# Altium project ServoControl.PrjPcb
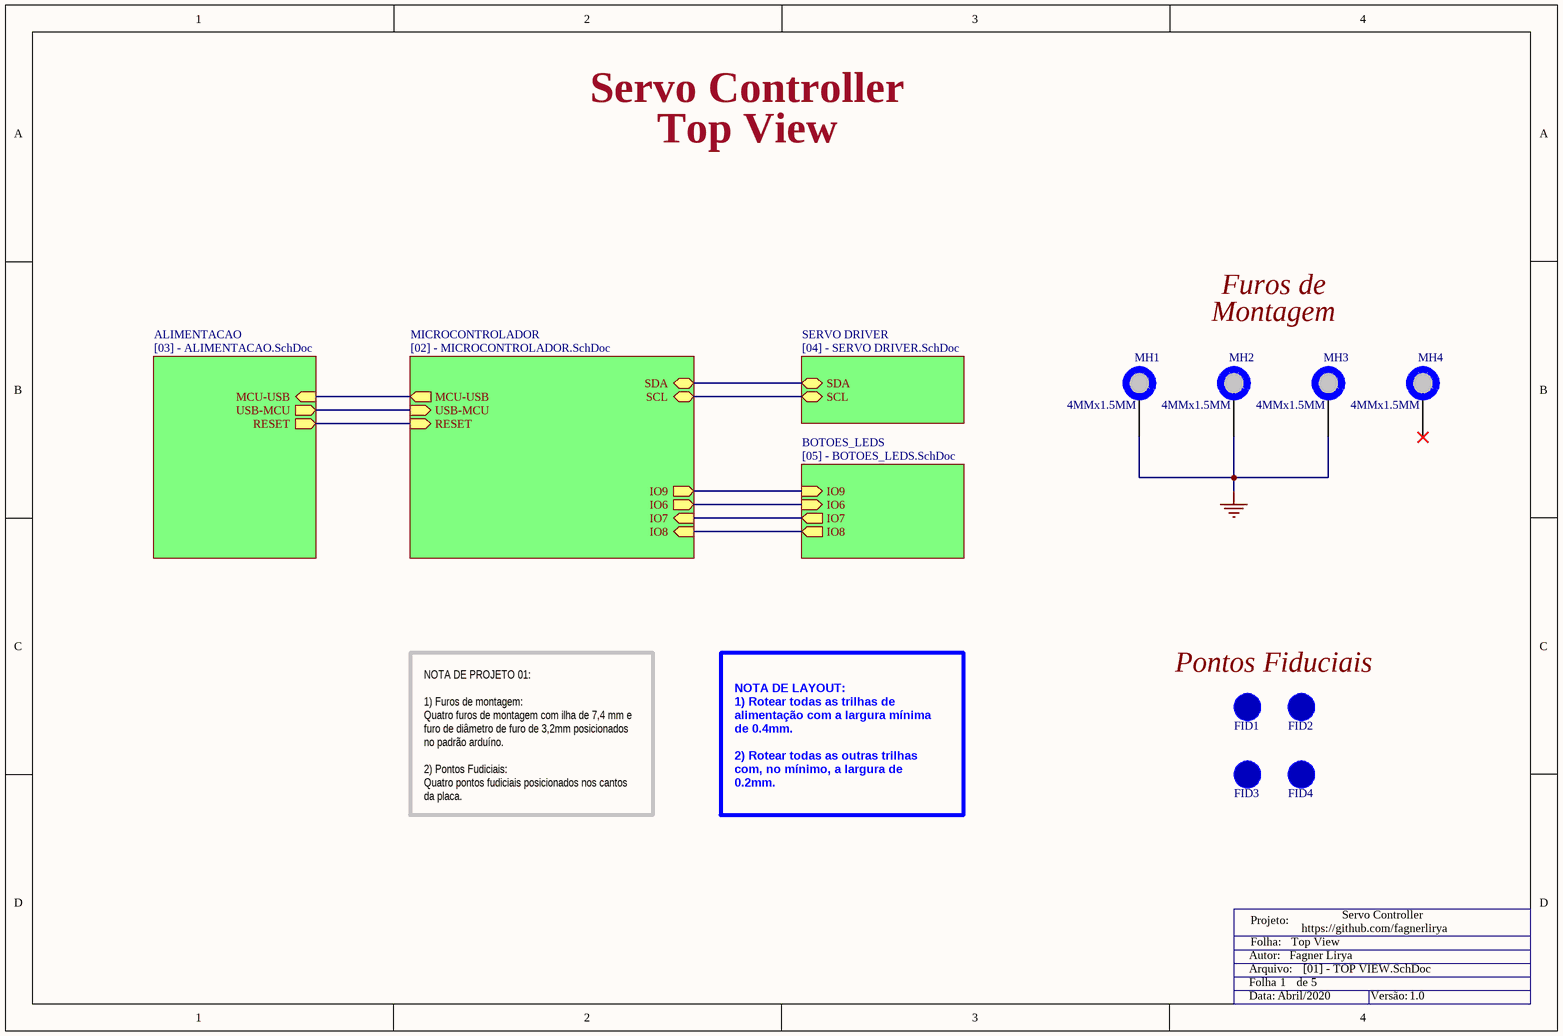
[diagram p0: [01] - TOP VIEW.SchDoc]
Autor: Fagner Lirya; Data: Abril/2020; NotFitted: NF; Projeto: Servo Controller; Repositorio: https://github.com/fagnerlirya; Title: Servo Controller v1.0; Versao: 1.0
3 sheets, 79 parts. Net scope: hierarchical (ports join the sheet entries above them; power ports are global).
Board file: Servo_Control.PcbDoc
Sheets:
  [01] - TOP VIEW.SchDoc
    ALIMENTACAO = [03] - ALIMENTACAO.SchDoc
    MICROCONTROLADOR = [02] - MICROCONTROLADOR.SchDoc

## Sheet [01] - TOP VIEW.SchDoc: Servo Controller v1.0
size A4; DocumentNumber: 1; SheetNumber: 1; SheetTotal: 5; Folha: Top View

### Parts
FID1  FID_1MMC  [FID_40X120D]  (value not drawn)  (no BOM)
FID2  FID_1MMC  [FID_40X120D]  (value not drawn)  (no BOM)
FID3  FID_1MMC  [FID_40X120D]  (value not drawn)  (no BOM)
FID4  FID_1MMC  [FID_40X120D]  (value not drawn)  (no BOM)
MH1  4MMx1.5MM  [MH_7.4MMD_3.2MMD]  (no BOM)
MH2  4MMx1.5MM  [MH_7.4MMD_3.2MMD]  (no BOM)
MH3  4MMx1.5MM  [MH_7.4MMD_3.2MMD]  (no BOM)
MH4  4MMx1.5MM  [MH_7.4MMD_3.2MMD_NON_COPPER_NPTH]  (no BOM)
TitleBlock1  Title Block  (value not drawn)  (graphical)

### Sub-sheets
ALIMENTACAO = [03] - ALIMENTACAO.SchDoc: MCU-USB (in), USB-MCU (out), RESET (out)
BOTOES_LEDS = [05] - BOTOES_LEDS.SchDoc (file not in this document): IO7 (out), IO8 (out), IO6 (in), IO9 (in)
MICROCONTROLADOR = [02] - MICROCONTROLADOR.SchDoc: USB-MCU (in), MCU-USB (out), RESET (in), SDA (bidir), SCL (bidir), IO9 (out), IO6 (out), IO7 (in), IO8 (in)
SERVO DRIVER = [04] - SERVO DRIVER.SchDoc (file not in this document): SDA (bidir), SCL (bidir)

### Nets
GND: MH1.1 MH2.1 MH3.1
IO6: sheet MICROCONTROLADOR/IO6, sheet BOTOES_LEDS/IO6
IO7: sheet MICROCONTROLADOR/IO7, sheet BOTOES_LEDS/IO7
IO8: sheet MICROCONTROLADOR/IO8, sheet BOTOES_LEDS/IO8
IO9: sheet MICROCONTROLADOR/IO9, sheet BOTOES_LEDS/IO9
RESET: sheet ALIMENTACAO/RESET, sheet MICROCONTROLADOR/RESET
SCL: sheet MICROCONTROLADOR/SCL, sheet SERVO DRIVER/SCL
SDA: sheet MICROCONTROLADOR/SDA, sheet SERVO DRIVER/SDA
NetR11_2: sheet ALIMENTACAO/USB-MCU, sheet MICROCONTROLADOR/USB-MCU
NetR12_2: sheet ALIMENTACAO/MCU-USB, sheet MICROCONTROLADOR/MCU-USB

Not connected (* = marked no-connect by the designer): MH4 1*

### Notes on the sheet
- Servo Controller
- Top View
- Furos de
- Montagem
- Pontos Fiduciais
- NOTA DE LAYOUT:
  1) Rotear todas as trilhas de alimentação com a largura mínima de 0.4mm.
  2) Rotear todas as outras trilhas com, no mínimo, a largura de  0.2mm.
- NOTA DE PROJETO 01:
  1) Furos de montagem:
  Quatro furos de montagem com ilha de 7,4 mm e furo de diâmetro de furo de 3,2mm posicionados no padrão arduíno.
  2) Pontos Fudiciais:
  Quatro pontos fudiciais posicionados nos cantos da placa.
- (in symbol Title Block) Projeto:; Folha:; Autor:; Arquivo:; Folha; de; Data:; Versão:

### Library data of the parts
FID1-FID4 = FID_1MMC: Fiducial 40mil Diameter, 120mil Mask
MH1-MH4 = PAD_WITH_HOLE_4MMx1.5MM: Pad with a hole 4mm x 1.5mm

## Sheet [03] - ALIMENTACAO.SchDoc: Servo Controller v1.0
size A4; DocumentNumber: 3; SheetNumber: 3; SheetTotal: 5; Folha: Alimentação
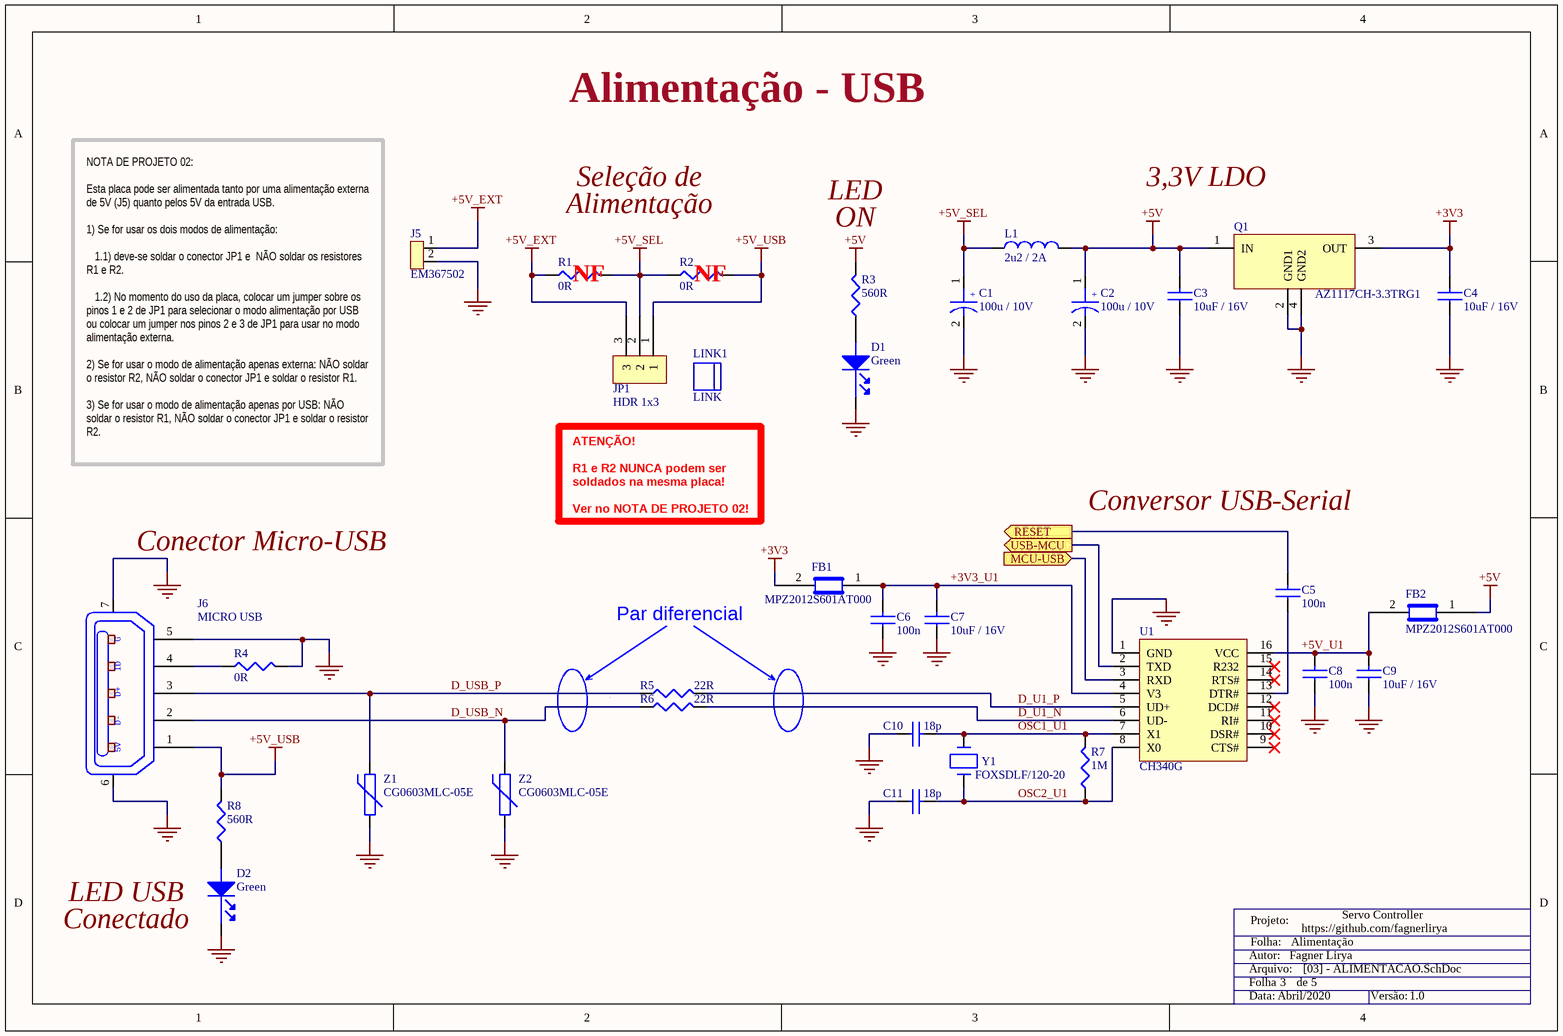
[diagram p1: [03] - ALIMENTACAO.SchDoc]

### Parts
C1  100u / 10V  [C_ALU_C_SIZE]
C2  100u / 10V  [C_ALU_C_SIZE]
C3  10uF / 16V  [C0805]
C4  10uF / 16V  [C0805]
C5  100n  [C0805]
C6  100n  [C0805]
C7  10uF / 16V  [C0805]
C8  100n  [C0805]
C9  10uF / 16V  [C0805]
C10  18p  [C0805]
C11  18p  [C0805]
D1  Green  [LED_0603]
D2  Green  [LED_0603]
FB1  MPZ2012S601AT000  [C0805]
FB2  MPZ2012S601AT000  [C0805]
J5  EM367502  [2_Pins_Fixed_Terminal]
J6  MICRO USB  [USB_ML]
JP1  HDR 1x3  [Hdr_1x3_2.54mm]
L1  2u2 / 2A  [C1210_IND]
LINK1  LINK  (mechanical)
Q1  AZ1117CH-3.3TRG1  [SOT223]
R1  0R  [R0805]
R2  0R  [R0805]
R3  560R  [R0805]
R4  0R  [R0805]
R5  22R  [R0805]
R6  22R  [R0805]
R7  1M  [R0805]
R8  560R  [R0805]
TitleBlock2  Title Block  (value not drawn)  (graphical)
U1  CH340G  [SO-16]
Y1  FOXSDLF/120-20  [HC49SD]
Z1  CG0603MLC-05E  [R0603]
Z2  CG0603MLC-05E  [R0603]

### Ports
MCU-USB (in), RESET (out), USB-MCU (out)

### Nets
+3V3: C4.2 FB1.2 Q1.3(OUT)
+5V: C2.1 C3.2 FB2.1 L1.2 Q1.1(IN) R3.2
+5V_EXT: J5.1 JP1.3 R1.1
+5V_SEL: C1.1 JP1.2 L1.1 R1.2 R2.1
+5V_USB: J6.1 JP1.1 R2.2 R8.2
GND: C1.2 C2.2 C3.1 C4.1 C6.1 C7.1 C8.1 C9.1 C10.1 C11.1 D1.1(Cathode) D2.1(Cathode) J5.2 J6.5 J6.6 J6.7 Q1.2(GND1) Q1.4(GND2) R4.2 U1.1(GND) Z1.1 Z2.1
+3V3_U1: C6.2 C7.2 FB1.1 U1.4(V3)
+5V_U1: C8.2 C9.2 FB2.2 U1.16(VCC)
D_U1_N: R6.2 U1.6(UD-)
D_U1_P: R5.2 U1.5(UD+)
D_USB_N: J6.2 R6.1 Z2.2
D_USB_P: J6.3 R5.1 Z1.2
OSC1_U1: C10.2 R7.2 U1.7(X1) Y1.2
OSC2_U1: C11.2 R7.1 U1.8(X0) Y1.1
RESET: C5.2 ; port RESET
NetC5_1: C5.1 U1.13(DTR#)
NetD1_2: D1.2(Anode) R3.1
NetD2_2: D2.2(Anode) R8.1
NetJ6_4: J6.4 R4.1
NetR11_2: U1.2(TXD) ; port USB-MCU
NetR12_2: U1.3(RXD) ; port MCU-USB

Not connected (* = marked no-connect by the designer): U1 9(CTS#)* 10(DSR#)* 11(RI#)* 12(DCD#)* 14(RTS#)* 15(R232)*

### Notes on the sheet
- Alimentação - USB
- Seleção de
- Alimentação
- LED
- (near R3) ON
- 3,3V LDO
- NOTA DE PROJETO 02:
  Esta placa pode ser alimentada tanto por uma alimentação externa de 5V (J5) quanto pelos 5V da entrada USB.
  1) Se for usar os dois modos de alimentação:
  1.1) deve-se soldar o conector JP1 e  NÃO soldar os resistores R1 e R2.
  1.2) No momento do uso da placa, colocar um jumper sobre os pinos 1 e 2 de JP1 para selecionar o modo alimentação por USB ou colocar um jumper nos pinos 2 e 3 de JP1 para usar no modo alimentação externa.
  2) Se for usar o modo de alimentação apenas externa: NÃO soldar o resistor R2, NÃO soldar o conector JP1 e soldar o resistor R1.
  3) Se for usar o modo de alimentação apenas por USB: NÃO soldar o resistor R1, NÃO soldar o conector JP1 e soldar o resistor R2.
- Conversor USB-Serial
- Conector Micro-USB
- ATENÇÃO!
  R1 e R2 NUNCA podem ser soldados na mesma placa!
  Ver no NOTA DE PROJETO 02!
- Par diferencial
- LED USB
- (near D2) Conectado
- (in symbol EEE-1AA101WR) +
- (in symbol Title Block) Projeto:; Folha:; Autor:; Arquivo:; Folha; de; Data:; Versão:
- (in symbol USB-ML) G; ID; D+; D-; 5V

### Library data of the parts
C1 C2 = EEE-1AA101WR: CAP ALUM 100UF 20% 10V SMD; Manufacturer: Panasonic Electronic Components; Capacitance: 100µF; Lifetime @ Temp.: 1000 Hrs @ 85°C; Ripple Current: 50mA; Surface Mount Land Size: 0.209" L x 0.209" W (5.30mm x 5.30mm); Supplier 1: Digi-Key; Manufacturer Part Number: EEE-1AA101WR; RoHS: RoHS Compliant; Category: Capacitors; Stock 1: 104915; Pricing 1: 1=0.44, 10=0.345, 25=0.2904, 50=0.249, 100=0.2076, 250=0.15568, 500=0.13284 (USD); Packaging: Cut Tape (CT); Tolerance: ±20%; Voltage Rating: 10V; ESR (Equivalent Series Resistance): -; Operating Temperature: -40°C ~ 85°C; Type: -; Applications: Automotive; Impedance: -; Lead Spacing: -; Size / Dimension: 0.197" Dia (5.00mm); Height - Seated (Max): 0.213" (5.40mm); Mounting Type: Surface Mount; Package / Case: Radial, Can - SMD; ComponentLink1URL: http://media.digikey.com/pdf/Data%20Sheets/Panasonic%20Electronic%20Components/S_Series_Type_V.pdf; ComponentLink1Description: http://media.digikey.com/pdf/Data%20Sheets/Panasonic%20Electronic%20Components/S_Series_Type_V.pdf; Supplier Part Number 1: PCE3867CT-ND
C3 C4 C7 C9 = C2012X5R1C106M125AC: CAP CER 10UF 16V X5R 0805; Manufacturer: TDK Corporation; Capacitance: 10µF; Tolerance: ±20%; Supplier 1: Digi-Key; Manufacturer Part Number: C2012X5R1C106M125AC; RoHS: RoHS Compliant; Category: Capacitors; Stock 1: 72024; Pricing 1: 1=0.33, 10=0.272, 100=0.136, 250=0.102, 500=0.0901, 1000=0.0799 (USD); Packaging: Cut Tape (CT); Voltage - Rated: 16V; Temperature Coefficient: X5R; Mounting Type: Surface Mount, MLCC; Operating Temperature: -55°C ~ 85°C; Applications: General Purpose; Ratings: -; Package / Case: 0805 (2012 Metric); Size / Dimension: 0.079" L x 0.049" W (2.00mm x 1.25mm); Height - Seated (Max): -; Thickness (Max): 0.057" (1.45mm); Lead Spacing: -; Features: -; Lead Style: -; ComponentLink1URL: https://product.tdk.com/info/en/catalog/datasheets/mlcc_commercial_general_en.pdf; ComponentLink1Description: https://product.tdk.com/info/en/catalog/datasheets/mlcc_commercial_general_en.pdf; Supplier Part Number 1: 445-4115-1-ND
C5 C6 C8 = C2012X7R1H104K085AA_1: CAP CER 0.1UF 50V X7R 0805; Manufacturer: TDK Corporation; Capacitance: 0.1µF; Tolerance: ±10%; Supplier 1: Digi-Key; Manufacturer Part Number: C2012X7R1H104K085AA; RoHS: RoHS Compliant; Category: Capacitors; Stock 1: 335513; Pricing 1: 1=0.1, 10=0.066, 100=0.0303, 250=0.02476, 500=0.02118, 1000=0.0165 (USD); Packaging: Cut Tape (CT); Voltage - Rated: 50V; Temperature Coefficient: X7R; Mounting Type: Surface Mount, MLCC; Operating Temperature: -55°C ~ 125°C; Applications: General Purpose; Ratings: -; Package / Case: 0805 (2012 Metric); Size / Dimension: 0.079" L x 0.049" W (2.00mm x 1.25mm); Height - Seated (Max): -; Thickness (Max): 0.037" (0.95mm); Lead Spacing: -; Features: -; Lead Style: -; ComponentLink1URL: https://product.tdk.com/info/en/catalog/datasheets/mlcc_commercial_general_en.pdf; ComponentLink1Description: https://product.tdk.com/info/en/catalog/datasheets/mlcc_commercial_general_en.pdf; Supplier Part Number 1: 445-7534-1-ND
C10 C11 = C0805C180J5GACTU: CAP CER 18PF 50V NP0 0805; Manufacturer: Kemet; Tolerance: ±5%; Temperature Coefficient: C0G, NP0; Supplier 1: Digi-Key; Manufacturer Part Number: C0805C180J5GACTU; RoHS: RoHS Compliant; Category: Capacitors; Stock 1: 159749; Pricing 1: 1=0.11, 10=0.082, 50=0.0442, 100=0.0374, 250=0.0306, 500=0.02618, 1000=0.0204 (USD); Packaging: Cut Tape (CT); Capacitance: 18pF; Voltage - Rated: 50V; Mounting Type: Surface Mount, MLCC; Operating Temperature: -55°C ~ 125°C; Applications: General Purpose; Ratings: -; Package / Case: 0805 (2012 Metric); Size / Dimension: 0.079" L x 0.049" W (2.00mm x 1.25mm); Height - Seated (Max): -; Thickness (Max): 0.035" (0.88mm); Lead Spacing: -; Features: -; Lead Style: -; ComponentLink1URL: http://www.kemet.com/docfinder?Partnumber=C0805C180J5GACTU; ComponentLink1Description: http://www.kemet.com/docfinder?Partnumber=C0805C180J5GACTU; Supplier Part Number 1: 399-1112-1-ND
D1 D2 = LG L29K-G2J1-24-Z: LED GREEN DIFFUSED 0603 SMD; Manufacturer: OSRAM Opto Semiconductors Inc.; Lens Color: White; Millicandela Rating: 3.92mcd; Lens Style/Size: Rectangle with Flat Top, 1.30mm x 0.80mm; Voltage - Forward (Vf) (Typ): 1.7V; Current - Test: 2mA; Viewing Angle: 160°; Wavelength - Dominant: 570nm; Wavelength - Peak: 572nm; Supplier 1: Digi-Key; Manufacturer Part Number: LG L29K-G2J1-24-Z; RoHS: RoHS Compliant; Category: Optoelectronics; Stock 1: 208577; Pricing 1: 1=0.36, 10=0.279, 25=0.2268, 100=0.1805, 250=0.15472, 500=0.1341, 1000=0.10316, 2500=0.09284 (USD); Packaging: Cut Tape (CT); Color: Green; Lens Transparency: Diffused; Mounting Type: Surface Mount; Features: -; Package / Case: 0603 (1608 Metric); Supplier Device Package: *; Size / Dimension: 1.70mm L x 0.80mm W; Height (Max): 0.65mm; ComponentLink1URL: http://www.osram-os.com/Graphics/XPic2/00077107_0.pdf; ComponentLink1Description: http://www.osram-os.com/Graphics/XPic2/00077107_0.pdf; Supplier Part Number 1: 475-2709-1-ND
FB1 FB2 = MPZ2012S601AT000: FERRITE CHIP BEAD 600 OHM SMD; Manufacturer: TDK Corporation; Impedance @ Frequency: 600 Ohm @ 100MHz; Current Rating: 2A; DC Resistance (DCR): 100 mOhm Max; Filter Type: Differential Mode - Single; Supplier 1: Digi-Key; Manufacturer Part Number: MPZ2012S601AT000; RoHS: RoHS Compliant; Category: Filters; Stock 1: 93838; Pricing 1: 1=0.12, 10=0.101, 100=0.0574, 250=0.04528, 500=0.03824, 1000=0.03221 (USD); Packaging: Cut Tape (CT); Package / Case: 0805 (2012 Metric); Mounting Type: Surface Mount; Height (Max): 0.041" (1.05mm); Size / Dimension: 0.079" L x 0.049" W (2.00mm x 1.25mm); ComponentLink1URL: https://product.tdk.com/info/en/catalog/datasheets/beads_commercial_power_mpz2012_en.pdf; ComponentLink1Description: https://product.tdk.com/info/en/catalog/datasheets/beads_commercial_power_mpz2012_en.pdf; Supplier Part Number 1: 445-2206-1-ND
J5 = EM367502: Fixed Terminal Blocks EURO (MA311-50002) TERM; Manufacturer: Bussmann / Eaton; Connection Method: Spring Cage; Current Rating: 10 A; Mounting Angle: Vertical; Number of Positions: 2 Position; Voltage Rating: 300 V; Pitch: 5 mm; Wire Gauge Range: 26 AWG to 14 AWG; Supplier 1: Mouser; Manufacturer Part Number: EM367502; RoHS: RoHS Compliant; Category: Fixed Terminal Blocks; Stock 1: 1498; Pricing 1: 1=0.260, 10=0.250, 100=0.240, 250=0.226, 500=0.214, 1000=0.203, 2000=0.190, 5000=0.179, 10000=0.164 (USD); Color: Green; Contact Plating: Tin; Housing Material: Thermoplastic; Packaging: Bulk; Product: Fixed Terminal Blocks; Series: EM3675; Termination Style: Through Hole; Brand: Bussmann / Eaton; Contact Material: Brass; Flammability Rating: UL 94 V-0; Standard Pack Qty: 100; Tradename: EuroMag; RoHS - Mouser: Y; Minimum Order Quantity: 1; Reeling: False; ComponentLink1URL: http://www.mouser.com/ds/2/87/Bus_Elx_DS_EM3675_Spring_Clamp-1066360.pdf; ComponentLink1Description: http://www.mouser.com/ds/2/87/Bus_Elx_DS_EM3675_Spring_Clamp-1066360.pdf; Supplier Part Number 1: 504-EM367502
J6 = USB-ML: CONN USB MICRO B RECPT SMT R/A; Manufacturer: ??; Manufacturer Part Number: ML-01; Connector Type: USB - micro B; Number of Contacts: 5; Gender: Receptacle; Specifications: USB 2.0; RoHS: RoHS Compliant; Category: Connectors, Interconnects; Pricing 1: 1=0.46, 10=0.433, 25=0.3712, 50=0.3156, 100=0.3032, 250=0.27224, 500=0.25988 (USD); Packaging: Cut Tape (CT); Mounting Type: Surface Mount, Right Angle, Horizontal; Features: Shielded, Solder Retention; Ingress Protection: -
JP1 = 68000-103HLF: BERGSTIK II .100" SR STRAIGHT; Manufacturer: FCI; Connector Type: Header, Unshrouded; Number of Positions: 3; Number of Positions Loaded: All; Pitch: 0.100" (2.54mm); Supplier 1: Digi-Key; Manufacturer Part Number: 68000-103HLF; RoHS: RoHS Compliant; Category: Connectors, Interconnects; Stock 1: 54154; Pricing 1: 1=0.26, 10=0.249, 25=0.2136, 50=0.1816, 100=0.1744, 250=0.15664, 500=0.14952, 1000=0.1246, 2500=0.11392 (USD); Packaging: Bulk; Contact Type: Male Pin; Number of Rows: 1; Row Spacing: -; Contact Mating Length: 0.230" (5.84mm); Mounting Type: Through Hole; Termination: Solder; Fastening Type: -; Features: -; Contact Finish: Gold or Gold, GXT™; Contact Finish Thickness: 30µin (0.76µm); Color: Black; ComponentLink1URL: http://portal.fciconnect.com/Comergent//fci/drawing/68000.pdf; ComponentLink1Description: http://portal.fciconnect.com/Comergent//fci/drawing/68000.pdf; Supplier Part Number 1: 609-3461-ND
L1 = L1210R2R2MDWIT: FIXED IND 2.2UH 2A 80 MOHM SMD; Manufacturer: Kemet; Type: Wirewound; Material - Core: Ferrite; Inductance: 2.2µH; Tolerance: ±20%; Shielding: Unshielded; DC Resistance (DCR): 80 mOhm; Frequency - Self Resonant: 190MHz; Frequency - Test: 100kHz; Supplier 1: Digi-Key; Manufacturer Part Number: L1210R2R2MDWIT; RoHS: RoHS Compliant; Category: Inductors, Coils, Chokes; Stock 1: 1408; Pricing 1: 1=0.54, 10=0.476, 25=0.4464, 50=0.3868, 100=0.357, 250=0.33916, 500=0.3094 (USD); Packaging: Cut Tape (CT); Current Rating: 2A; Current - Saturation: -; Q @ Freq: -; Operating Temperature: -40°C ~ 105°C; Mounting Type: Surface Mount; Package / Case: 1210 (3225 Metric); Size / Dimension: 0.126" L x 0.098" W (3.20mm x 2.50mm); Height - Seated (Max): 0.106" (2.70mm); Supplier Device Package: 1210; ComponentLink1URL: http://www.kemet.com/Lists/ProductCatalog/Attachments/57/F3115.pdf; ComponentLink1Description: http://www.kemet.com/Lists/ProductCatalog/Attachments/57/F3115.pdf; Supplier Part Number 1: 399-9598-1-ND
LINK1 = QPC02SXGN-RC: CONN JUMPER SHORTING .100" GOLD; Manufacturer: Sullins Connector Solutions; Gender: Female Sockets; Number of Positions or Pins (Grid): 2 (1 x 2); Pitch: 0.100" (2.54mm); Supplier 1: Digi-Key; Manufacturer Part Number: QPC02SXGN-RC; RoHS: RoHS Compliant; Category: Connectors, Interconnects; Stock 1: 91424; Pricing 1: 1=0.13, 10=0.077, 25=0.0548, 50=0.0448, 100=0.0385, 250=0.03256, 500=0.0301, 1000=0.0266, 2500=0.021 (USD); Packaging: Bulk; Type: Open Top; Height: 0.235" (5.97mm); Contact Finish: Gold; Contact Finish Thickness: Flash; Color: Black; ComponentLink1URL: http://www.sullinscorp.com/drawings/284_SXGN_11510.pdf; ComponentLink1Description: http://www.sullinscorp.com/drawings/284_SXGN_11510.pdf; Supplier Part Number 1: S9337-ND
Q1 = AZ1117CH-3.3TRG1: LDO Voltage Regulators LDO BJT HiCurr 1.15V at 1A; Manufacturer: Diodes Incorporated; Input Voltage MAX: 15 V; Number of Outputs: 1 Output; Output Current: 800 mA; Output Type: Fixed; Output Voltage: 3.3 V; Quiescent Current: 4 mA; Type: Linear Regulator; Dropout Voltage - Max: 1.3 V; PSRR / Ripple Rejection - Typ: 70 dB; Dropout Voltage: 1.2 V; Line Regulation: 500 uV; Load Regulation: 2 mV; Supplier 1: Mouser; Manufacturer Part Number: AZ1117CH-3.3TRG1; RoHS: RoHS Compliant; Category: LDO Voltage Regulators; Stock 1: 11685; Pricing 1: 1=0.380, 10=0.262, 100=0.120, 1000=0.093, 4000=0.079, 8000=0.072, 24000=0.067, 48000=0.060, 100000=0.058 (USD); Package / Case: SOT-223-3; Packaging: Cut Tape; Product: LDO Voltage Regulators; Series: AZ1117; Brand: Diodes Incorporated; Mounting Style: SMD/SMT; Output Voltage Range: -; Maximum Operating Temperature: + 125 C; Minimum Operating Temperature: - 20 C; Moisture Sensitive: Yes; Standard Pack Qty: 4000; RoHS - Mouser: Y; Minimum Order Quantity: 1; Reeling: True; ComponentLink1URL: http://www.mouser.com/ds/2/115/AZ1117C-271627.pdf; ComponentLink1Description: http://www.mouser.com/ds/2/115/AZ1117C-271627.pdf; Supplier Part Number 1: 621-AZ1117CH-3.3TRG1
R1 R2 R4 = RC0805JR-070RL: RES SMD 0.0 OHM JUMPER 1/8W 0805; Manufacturer: Yageo; Resistance (Ohms): 0.0; Power (Watts): 0.125W, 1/8W; Supplier 1: Digi-Key; Manufacturer Part Number: RC0805JR-070RL; RoHS: RoHS Compliant; Category: Resistors; Stock 1: 2285545; Pricing 1: 1=0.1, 10=0.018, 25=0.0128, 100=0.0073, 250=0.00556, 500=0.00444, 1000=0.00326, 2500=0.00283 (USD); Packaging: Cut Tape (CT); Tolerance: Jumper; Composition: Thick Film; Features: Moisture Resistant; Temperature Coefficient: -; Operating Temperature: -55°C ~ 155°C; Package / Case: 0805 (2012 Metric); Supplier Device Package: 0805; Size / Dimension: 0.079" L x 0.049" W (2.00mm x 1.25mm); Height: 0.024" (0.60mm); Number of Terminations: 2; ComponentLink1URL: http://www.yageo.com/NewPortal/yageodocoutput?fileName=/pdf/R-Chip/PYu-RC_Group_51_RoHS_L_3.pdf; ComponentLink1Description: http://www.yageo.com/NewPortal/yageodocoutput?fileName=/pdf/R-Chip/PYu-RC_Group_51_RoHS_L_3.pdf; Supplier Part Number 1: 311-0.0ARCT-ND
R3 R8 = RC0805FR-07560RL: RES SMD 560 OHM 1% 1/8W 0805; Manufacturer: Yageo; Resistance (Ohms): 560; Power (Watts): 0.125W, 1/8W; Temperature Coefficient: ±100ppm/°C; Supplier 1: Digi-Key; Manufacturer Part Number: RC0805FR-07560RL; RoHS: RoHS Compliant; Category: Resistors; Stock 1: 245556; Pricing 1: 1=0.1, 10=0.021, 25=0.0152, 100=0.0084, 250=0.00644, 500=0.00514, 1000=0.00379, 2500=0.00329 (USD); Packaging: Cut Tape (CT); Tolerance: ±1%; Composition: Thick Film; Features: Moisture Resistant; Operating Temperature: -55°C ~ 155°C; Package / Case: 0805 (2012 Metric); Supplier Device Package: 0805; Size / Dimension: 0.079" L x 0.049" W (2.00mm x 1.25mm); Height: 0.024" (0.60mm); Number of Terminations: 2; ComponentLink1URL: http://www.yageo.com/NewPortal/yageodocoutput?fileName=/pdf/R-Chip/PYu-RC_Group_51_RoHS_L_3.pdf; ComponentLink1Description: http://www.yageo.com/NewPortal/yageodocoutput?fileName=/pdf/R-Chip/PYu-RC_Group_51_RoHS_L_3.pdf; Supplier Part Number 1: 311-560CRCT-ND
R5 R6 = RC0805FR-0722RL: RES SMD 22 OHM 1% 1/8W 0805; Manufacturer: Yageo; Resistance (Ohms): 22; Power (Watts): 0.125W, 1/8W; Temperature Coefficient: ±100ppm/°C; Supplier 1: Digi-Key; Manufacturer Part Number: RC0805FR-0722RL; RoHS: RoHS Compliant; Category: Resistors; Stock 1: 106658; Pricing 1: 1=0.1, 10=0.021, 25=0.0152, 100=0.0084, 250=0.00644, 500=0.00514, 1000=0.00379, 2500=0.00329 (USD); Packaging: Cut Tape (CT); Tolerance: ±1%; Composition: Thick Film; Features: Moisture Resistant; Operating Temperature: -55°C ~ 155°C; Package / Case: 0805 (2012 Metric); Supplier Device Package: 0805; Size / Dimension: 0.079" L x 0.049" W (2.00mm x 1.25mm); Height: 0.024" (0.60mm); Number of Terminations: 2; ComponentLink1URL: http://www.yageo.com/NewPortal/yageodocoutput?fileName=/pdf/R-Chip/PYu-RC_Group_51_RoHS_L_3.pdf; ComponentLink1Description: http://www.yageo.com/NewPortal/yageodocoutput?fileName=/pdf/R-Chip/PYu-RC_Group_51_RoHS_L_3.pdf; Supplier Part Number 1: 311-22.0CRCT-ND
R7 = RC0805FR-071ML: RES SMD 1M OHM 1% 1/8W 0805; Manufacturer: Yageo; Power (Watts): 0.125W, 1/8W; Temperature Coefficient: ±100ppm/°C; Supplier 1: Digi-Key; Manufacturer Part Number: RC0805FR-071ML; RoHS: RoHS Compliant; Category: Resistors; Stock 1: 426248; Pricing 1: 1=0.1, 10=0.021, 25=0.0152, 100=0.0084, 250=0.00644, 500=0.00514, 1000=0.00379, 2500=0.00329 (USD); Packaging: Cut Tape (CT); Resistance (Ohms): 1M; Tolerance: ±1%; Composition: Thick Film; Features: Moisture Resistant; Operating Temperature: -55°C ~ 155°C; Package / Case: 0805 (2012 Metric); Supplier Device Package: 0805; Size / Dimension: 0.079" L x 0.049" W (2.00mm x 1.25mm); Height: 0.024" (0.60mm); Number of Terminations: 2; ComponentLink1URL: http://www.yageo.com/NewPortal/yageodocoutput?fileName=/pdf/R-Chip/PYu-RC_Group_51_RoHS_L_3.pdf; ComponentLink1Description: http://www.yageo.com/NewPortal/yageodocoutput?fileName=/pdf/R-Chip/PYu-RC_Group_51_RoHS_L_3.pdf; Supplier Part Number 1: 311-1.00MCRCT-ND
U1 = CH340G: USB bus adapters; Manufacturer: Chinese; Maximum Clock Frequency: 12 MHz; Operating Supply Voltage: 3.3 V to 5.5 V; Supply Voltage - Max: 5.5 V; Supply Voltage - Min: 3.3 V; Manufacturer Part Number: CH340G; Category: USB bus adapters; Pricing 1: 1=2.07, 25=1.89, 100=1.72, 1000=1.64 (USD); Package / Case: SO-16; Product: MCU; Series: CH340; Mounting Style: SMD/SMT; Maximum Operating Temperature: + 85 C; Minimum Operating Temperature: - 40 C; Minimum Order Quantity: 1
Y1 = FOXSDLF/120-20: Crystals 12MHz 20pF; Manufacturer: Fox; Frequency Stability: 50 PPM; Supplier 1: Mouser; Manufacturer Part Number: FOXSDLF/120-20; RoHS: RoHS Compliant; Category: Crystals; Stock 1: 4211; Pricing 1: 1=0.270, 10=0.225, 50=0.203, 100=0.180, 500=0.171, 1000=0.144, 2000=0.135, 5000=0.130, 10000=0.126 (USD); Frequency: 12 MHz; Height: 4.5 mm; Length: 13.9 mm; Load Capacitance: 20 pF; Package / Case: HC-49/US; Packaging: Cut Tape; Series: FOXSDLF; Termination Style: SMD/SMT; Tolerance: 50 PPM; Width: 5 mm; Brand: Fox; Mounting Style: SMD/SMT; Maximum Operating Temperature: + 70 C; Minimum Operating Temperature: - 10 C; Standard Pack Qty: 1000; RoHS - Mouser: Y; Minimum Order Quantity: 1; Reeling: True; ComponentLink1URL: http://www.mouser.com/ds/2/160/C4SD-1131563.pdf; ComponentLink1Description: http://www.mouser.com/ds/2/160/C4SD-1131563.pdf; Supplier Part Number 1: 559-FOXSD120-20-LF
Z1 Z2 = CG0603MLC-05E: VARISTOR 0603; Manufacturer: Bourns Inc.; Number of Circuits: 1; Maximum DC Volts: 5VDC; Supplier 1: Digi-Key; Manufacturer Part Number: CG0603MLC-05E; RoHS: RoHS Compliant; Category: Circuit Protection; Stock 1: 102370; Pricing 1: 1=0.19, 10=0.177, 25=0.164, 50=0.158, 100=0.1472, 250=0.13104, 500=0.1092, 1000=0.10348, 2500=0.09256 (USD); Packaging: Cut Tape (CT); Varistor Voltage (Min): -; Varistor Voltage (Typ): -; Varistor Voltage (Max): -; Current - Surge: -; Maximum AC Volts: -; Energy: -; Package / Case: 0603 (1608 Metric); Mounting Type: Surface Mount, MLCV; ComponentLink1URL: http://www.bourns.com/docs/Product-Datasheets/MLC.pdf; ComponentLink1Description: http://www.bourns.com/docs/Product-Datasheets/MLC.pdf; Supplier Part Number 1: CG0603MLC-05ECT-ND

## Sheet [02] - MICROCONTROLADOR.SchDoc: Servo Controller v1.0
size A4; DocumentNumber: 2; SheetNumber: 2; SheetTotal: 5; Folha: Microcontrolador
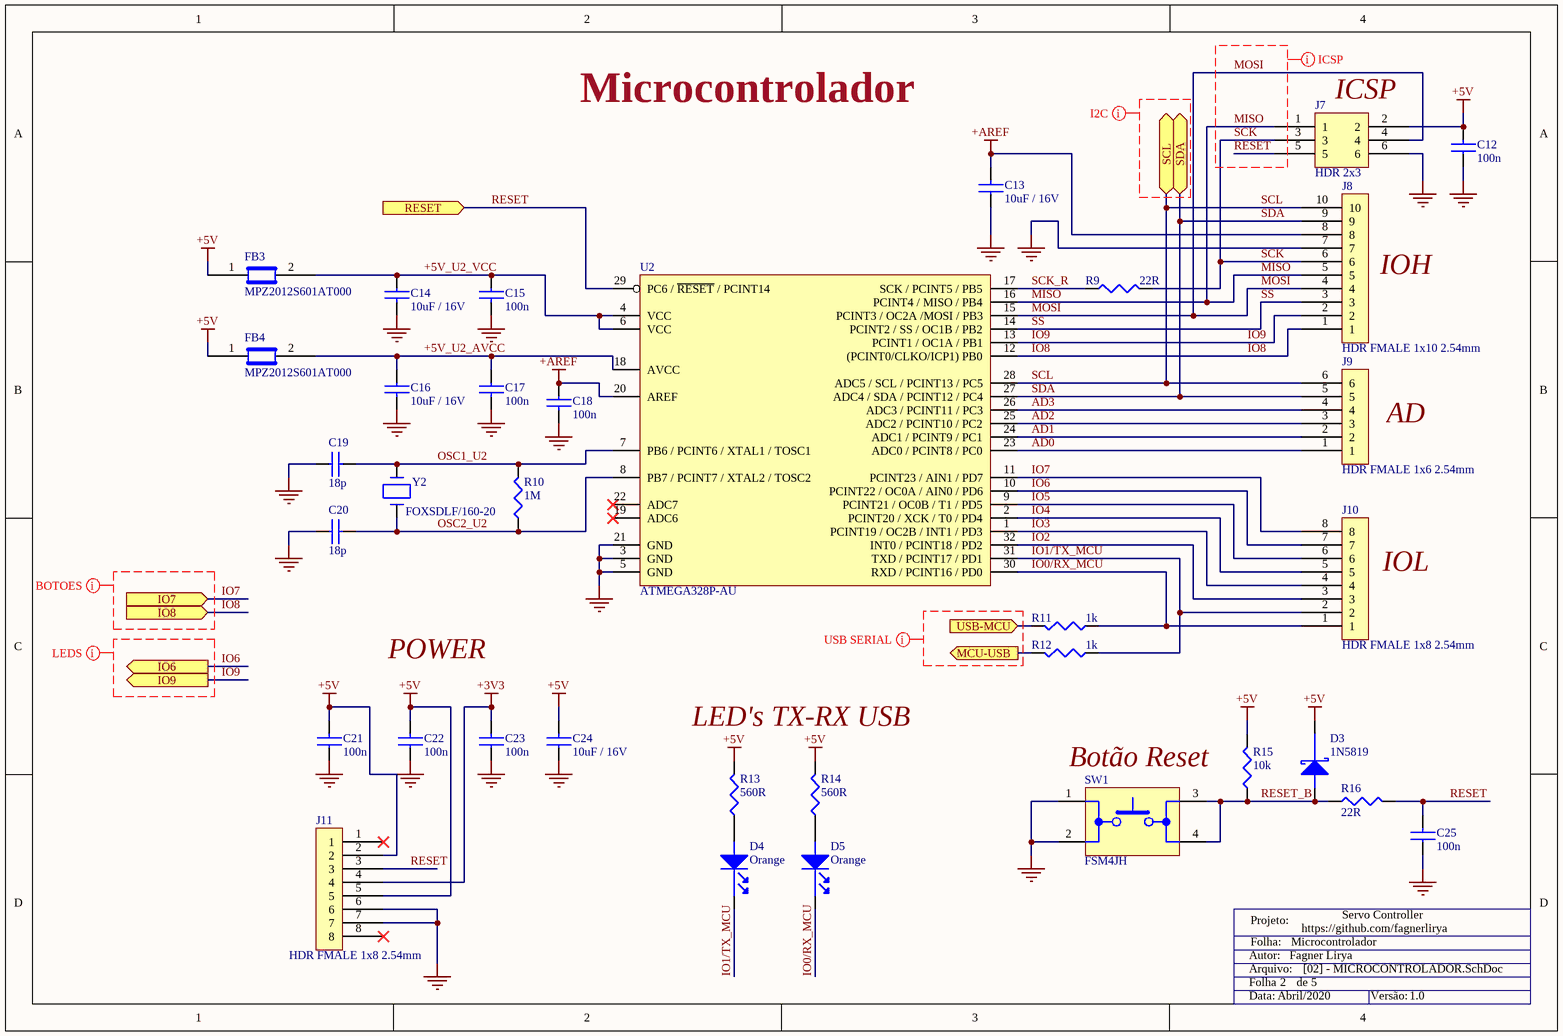
[diagram p2: [02] - MICROCONTROLADOR.SchDoc]

### Parts
C12  100n  [C0805]
C13  10uF / 16V  [C0805]
C14  10uF / 16V  [C0805]
C15  100n  [C0805]
C16  10uF / 16V  [C0805]
C17  100n  [C0805]
C18  100n  [C0805]
C19  18p  [C0805]
C20  18p  [C0805]
C21  100n  [C0805]
C22  100n  [C0805]
C23  100n  [C0805]
C24  10uF / 16V  [C0805]
C25  100n  [C0805]
D3  1N5819  [1N5819]
D4  Orange  [LED_0603]
D5  Orange  [LED_0603]
FB3  MPZ2012S601AT000  [C0805]
FB4  MPZ2012S601AT000  [C0805]
J7  HDR 2x3  [HDR_2x3_2.54MM]
J8  HDR FMALE 1x10 2.54mm  [Hdr_Female_1x10_2.54mm]
J9  HDR FMALE 1x6 2.54mm  [Hdr_Female_1x6_2.54mm]
J10  HDR FMALE 1x8 2.54mm  [Hdr_Female_1x8_2.54mm]
J11  HDR FMALE 1x8 2.54mm  [Hdr_Female_1x8_2.54mm]
R9  22R  [R0805]
R10  1M  [R0805]
R11  1k  [R0805]
R12  1k  [R0805]
R13  560R  [R0805]
R14  560R  [R0805]
R15  10k  [R0805]
R16  22R  [R0805]
SW1  FSM4JH  [FSM4JH]
TitleBlock3  Title Block  (value not drawn)  (graphical)
U2  ATMEGA328P-AU  [TQFP32]
Y2  FOXSDLF/160-20  [HC49SD]

### Ports
IO6 (out), IO7 (in), IO8 (in), IO9 (out), MCU-USB (out), RESET (in), SCL (bidir), SDA (bidir), USB-MCU (in)

### Nets
+3V3: C23.2 J11.4
+5V: C12.2 C21.2 C22.2 C24.2 D3.1(Cathode) FB3.1 FB4.1 J7.2 J11.2 J11.5 R13.2 R14.2 R15.2
+AREF: C13.2 C18.1 J8.8 U2.20(AREF)
GND: C12.1 C13.1 C14.2 C15.2 C16.2 C17.2 C18.2 C19.1 C20.1 C21.1 C22.1 C23.1 C24.1 C25.1 J7.6 J8.7 J11.6 J11.7 SW1.1 SW1.2 U2.3(GND) U2.5(GND) U2.21(GND)
+5V_U2_AVCC: C16.1 C17.1 FB4.2 U2.18(AVCC)
+5V_U2_VCC: C14.1 C15.1 FB3.2 U2.4(VCC) U2.6(VCC)
AD0: J9.1 U2.23(ADC0_/_PCINT8_/_PC0)
AD1: J9.2 U2.24(ADC1_/_PCINT9_/_PC1)
AD2: J9.3 U2.25(ADC2_/_PCINT10_/_PC2)
AD3: J9.4 U2.26(ADC3_/_PCINT11_/_PC3)
IO0/RX_MCU: D5.1(Cathode) J10.1 R11.1 U2.30(RXD_/_PCINT16_/_PD0)
IO1/TX_MCU: D4.1(Cathode) J10.2 R12.1 U2.31(TXD_/_PCINT17_/_PD1)
IO2: J10.3 U2.32(INT0_/_PCINT18_/_PD2)
IO3: J10.4 U2.1(PCINT19_/_OC2B_/_INT1_/_PD3)
IO4: J10.5 U2.2(PCINT20_/_XCK_/_T0_/_PD4)
IO5: J10.6 U2.9(PCINT21_/_OC0B_/_T1_/_PD5)
IO6: J10.7 U2.10(PCINT22_/_OC0A_/_AIN0_/_PD6) ; port IO6
IO7: J10.8 U2.11(PCINT23_/_AIN1_/_PD7) ; port IO7
IO8: J8.1 U2.12((PCINT0/CLKO/ICP1)_PB0) ; port IO8
IO9: J8.2 U2.13(PCINT1_/_OC1A_/_PB1) ; port IO9
MISO: J7.1 J8.5 U2.16(PCINT4_/_MISO_/_PB4)
MOSI: J7.4 J8.4 U2.15(PCINT3_/_OC2A_/MOSI_/_PB3)
OSC1_U2: C19.2 R10.2 U2.7(PB6_/_PCINT6_/_XTAL1_/_TOSC1) Y2.2
OSC2_U2: C20.2 R10.1 U2.8(PB7_/_PCINT7_/_XTAL2_/_TOSC2) Y2.1
RESET: C25.2 J7.5 J11.3 R16.2 U2.29(PC6_/_~{RESET}_/_PCINT14) ; port RESET
RESET_B: D3.2(Anode) R15.1 R16.1 SW1.3 SW1.4
SCK: J7.3 J8.6 R9.2
SCK_R: R9.1 U2.17(SCK_/_PCINT5_/_PB5)
SCL: J8.10 J9.6 U2.28(ADC5_/_SCL_/_PCINT13_/_PC5) ; port SCL
SDA: J8.9 J9.5 U2.27(ADC4_/_SDA_/_PCINT12_/_PC4) ; port SDA
SS: J8.3 U2.14(PCINT2_/_SS_/_OC1B_/_PB2)
NetD4_2: D4.2(Anode) R13.1
NetD5_2: D5.2(Anode) R14.1
NetR11_2: R11.2 ; port USB-MCU
NetR12_2: R12.2 ; port MCU-USB

Not connected (* = marked no-connect by the designer): J11 1* 8*; U2 19(ADC6)* 22(ADC7)*

### Layout directives
net class I2C: (no net found under the mark)
net class USB SERIAL: (no net found under the mark)
net class BOTOES: (no net found under the mark)
net class LEDS: (no net found under the mark)
net class ICSP: MISO, MOSI, RESET, SCK

### Notes on the sheet
- Microcontrolador
- (near J7) ICSP
- (near J8) IOH
- (near J9) AD
- (near J10) IOL
- POWER
- LED's TX-RX USB
- Botão Reset
- (in symbol Title Block) Projeto:; Folha:; Autor:; Arquivo:; Folha; de; Data:; Versão:

### Library data of the parts
C12 C15 C17 C18 C21-C23 C25 = C2012X7R1H104K085AA_1: as C5 on sheet [03] - ALIMENTACAO; Supplier 1: Digi-Key; Manufacturer Part Number: C2012X7R1H104K085AA; RoHS: RoHS Compliant; Category: Capacitors; Stock 1: 335513; Pricing 1: 1=0.1, 10=0.066, 100=0.0303, 250=0.02476, 500=0.02118, 1000=0.0165 (USD); Packaging: Cut Tape (CT); Voltage - Rated: 50V; Temperature Coefficient: X7R; Mounting Type: Surface Mount, MLCC; Operating Temperature: -55°C ~ 125°C; Applications: General Purpose; Ratings: -; Package / Case: 0805 (2012 Metric); Size / Dimension: 0.079" L x 0.049" W (2.00mm x 1.25mm); Height - Seated (Max): -; Thickness (Max): 0.037" (0.95mm); Lead Spacing: -; Features: -; Lead Style: -; ComponentLink1URL: https://product.tdk.com/info/en/catalog/datasheets/mlcc_commercial_general_en.pdf; ComponentLink1Description: https://product.tdk.com/info/en/catalog/datasheets/mlcc_commercial_general_en.pdf; Supplier Part Number 1: 445-7534-1-ND
C13 C14 C16 C24 = C2012X5R1C106M125AC: as C3 on sheet [03] - ALIMENTACAO; Supplier 1: Digi-Key; Manufacturer Part Number: C2012X5R1C106M125AC; RoHS: RoHS Compliant; Category: Capacitors; Stock 1: 72024; Pricing 1: 1=0.33, 10=0.272, 100=0.136, 250=0.102, 500=0.0901, 1000=0.0799 (USD); Packaging: Cut Tape (CT); Voltage - Rated: 16V; Temperature Coefficient: X5R; Mounting Type: Surface Mount, MLCC; Operating Temperature: -55°C ~ 85°C; Applications: General Purpose; Ratings: -; Package / Case: 0805 (2012 Metric); Size / Dimension: 0.079" L x 0.049" W (2.00mm x 1.25mm); Height - Seated (Max): -; Thickness (Max): 0.057" (1.45mm); Lead Spacing: -; Features: -; Lead Style: -; ComponentLink1URL: https://product.tdk.com/info/en/catalog/datasheets/mlcc_commercial_general_en.pdf; ComponentLink1Description: https://product.tdk.com/info/en/catalog/datasheets/mlcc_commercial_general_en.pdf; Supplier Part Number 1: 445-4115-1-ND
C19 C20 = C0805C180J5GACTU: as C10 on sheet [03] - ALIMENTACAO; Supplier 1: Digi-Key; Manufacturer Part Number: C0805C180J5GACTU; RoHS: RoHS Compliant; Category: Capacitors; Stock 1: 159749; Pricing 1: 1=0.11, 10=0.082, 50=0.0442, 100=0.0374, 250=0.0306, 500=0.02618, 1000=0.0204 (USD); Packaging: Cut Tape (CT); Capacitance: 18pF; Voltage - Rated: 50V; Mounting Type: Surface Mount, MLCC; Operating Temperature: -55°C ~ 125°C; Applications: General Purpose; Ratings: -; Package / Case: 0805 (2012 Metric); Size / Dimension: 0.079" L x 0.049" W (2.00mm x 1.25mm); Height - Seated (Max): -; Thickness (Max): 0.035" (0.88mm); Lead Spacing: -; Features: -; Lead Style: -; ComponentLink1URL: http://www.kemet.com/docfinder?Partnumber=C0805C180J5GACTU; ComponentLink1Description: http://www.kemet.com/docfinder?Partnumber=C0805C180J5GACTU; Supplier Part Number 1: 399-1112-1-ND
D3 = 1N5819: Schottky Diodes & Rectifiers Schottky Barrier; Manufacturer: ON Semiconductor / Fairchild; Configuration: Single; If - Forward Current: 1 A; Ifsm - Forward Surge Current: 25 A; Ir - Reverse Current: 500 uA; Vf - Forward Voltage: 0.6 V; Vrrm - Repetitive Reverse Voltage: 40 V; Supplier 1: Mouser; Manufacturer Part Number: 1N5819; RoHS: RoHS Compliant; Category: Schottky Diodes & Rectifiers; Stock 1: 19180; Pricing 1: 1=0.380, 10=0.266, 100=0.122, 1000=0.094, 5000=0.080, 10000=0.073, 25000=0.068, 50000=0.061, 100000=0.059 (USD); Height: 2.72 mm (Max); Length: 5.21 mm (Max); Operating Temperature Range: - 65 C to + 125 C; Package / Case: DO-41; Packaging: Cut Tape; Product: Schottky Rectifiers; Series: 1N5819; Technology: Si; Type: Schottky Diode; Width: 2.72 mm (Max); Brand: ON Semiconductor / Fairchild; Mounting Style: Through Hole; Maximum Operating Temperature: + 125 C; Minimum Operating Temperature: - 65 C; Standard Pack Qty: 5000; RoHS - Mouser: Y; Minimum Order Quantity: 1; Reeling: True; ComponentLink1URL: http://www.mouser.com/ds/2/308/1N5819-1118406.pdf; ComponentLink1Description: http://www.mouser.com/ds/2/308/1N5819-1118406.pdf; Supplier Part Number 1: 512-1N5819
D4 D5 = LO L29K-H2K1-24-Z: LED ORANGE DIFFUSED 0603 SMD; Manufacturer: OSRAM Opto Semiconductors Inc.; Lens Color: White; Millicandela Rating: 6.3mcd; Lens Style/Size: Rectangle with Flat Top, 1.30mm x 0.80mm; Voltage - Forward (Vf) (Typ): 1.8V; Current - Test: 2mA; Viewing Angle: 160°; Wavelength - Dominant: 606nm; Wavelength - Peak: 610nm; Supplier 1: Digi-Key; Manufacturer Part Number: LO L29K-H2K1-24-Z; RoHS: RoHS Compliant; Category: Optoelectronics; Stock 1: 3671; Pricing 1: 1=0.42, 10=0.299, 25=0.2456, 100=0.1964, 250=0.14728, 500=0.1339, 1000=0.10712, 2500=0.08703 (USD); Packaging: Cut Tape (CT); Color: Orange; Lens Transparency: Diffused; Mounting Type: Surface Mount; Features: -; Package / Case: 0603 (1608 Metric); Supplier Device Package: *; Size / Dimension: 1.70mm L x 0.80mm W; Height (Max): 0.65mm; ComponentLink1URL: http://www.osram-os.com/Graphics/XPic0/00077105_0.pdf; ComponentLink1Description: http://www.osram-os.com/Graphics/XPic0/00077105_0.pdf; Supplier Part Number 1: 475-2740-1-ND
FB3 FB4 = MPZ2012S601AT000: as FB1 on sheet [03] - ALIMENTACAO; Supplier 1: Digi-Key; Manufacturer Part Number: MPZ2012S601AT000; RoHS: RoHS Compliant; Category: Filters; Stock 1: 93838; Pricing 1: 1=0.12, 10=0.101, 100=0.0574, 250=0.04528, 500=0.03824, 1000=0.03221 (USD); Packaging: Cut Tape (CT); Package / Case: 0805 (2012 Metric); Mounting Type: Surface Mount; Height (Max): 0.041" (1.05mm); Size / Dimension: 0.079" L x 0.049" W (2.00mm x 1.25mm); ComponentLink1URL: https://product.tdk.com/info/en/catalog/datasheets/beads_commercial_power_mpz2012_en.pdf; ComponentLink1Description: https://product.tdk.com/info/en/catalog/datasheets/beads_commercial_power_mpz2012_en.pdf; Supplier Part Number 1: 445-2206-1-ND
J7 = 67997-106HLF: CONN HEADER 6POS .100 STR 30AU; Manufacturer: FCI; Connector Type: Header, Unshrouded; Number of Positions: 6; Number of Positions Loaded: All; Pitch: 0.100" (2.54mm); Supplier 1: Digi-Key; Manufacturer Part Number: 67997-106HLF; RoHS: RoHS Compliant; Category: Connectors, Interconnects; Stock 1: 1415; Pricing 1: 1=1.64, 10=1.489, 25=1.3976, 50=1.3368, 100=1.276, 250=1.15444, 500=1.0633, 1000=0.9114, 2500=0.85064 (USD); Packaging: Bulk; Contact Type: Male Pin; Number of Rows: 2; Row Spacing: 0.100" (2.54mm); Contact Mating Length: 0.230" (5.84mm); Mounting Type: Through Hole; Termination: Solder; Fastening Type: -; Features: -; Contact Finish: Gold or Gold, GXT™; Contact Finish Thickness: 30µin (0.76µm); Color: Black; ComponentLink1URL: http://portal.fciconnect.com/Comergent//fci/drawing/67996.pdf; ComponentLink1Description: http://portal.fciconnect.com/Comergent//fci/drawing/67996.pdf; Supplier Part Number 1: 609-3393-ND
J8 = M20-7821046: 10-WAY SIL VERT SOCKET L/FREE; Manufacturer: Harwin Inc.; Connector Type: Receptacle; Number of Positions: 10; Number of Positions Loaded: All; Pitch: 0.100" (2.54mm); Supplier 1: Digi-Key; Manufacturer Part Number: M20-7821046; RoHS: RoHS Compliant; Category: Connectors, Interconnects; Stock 1: 297; Pricing 1: 1=1.28, 23=1.12217, 46=1.05609, 69=1.01203, 115=0.968, 253=0.88, 506=0.792, 1012=0.704, 2507=0.638 (USD); Packaging: Tube; Contact Type: Female Socket; Number of Rows: 1; Row Spacing: -; Mounting Type: Through Hole; Termination: Solder; Fastening Type: -; Features: -; Contact Finish: Tin; Contact Finish Thickness: -; Color: Black; ComponentLink1URL: http://cdn.harwin.com/pdfs/M20-782.pdf; ComponentLink1Description: http://cdn.harwin.com/pdfs/M20-782.pdf; Supplier Part Number 1: 952-1847-ND
J9 = M20-7820646: 06-WAY SIL VERT SOCKET L/FREE; Manufacturer: Harwin Inc.; Connector Type: Receptacle; Number of Positions: 6; Number of Positions Loaded: All; Pitch: 0.100" (2.54mm); Supplier 1: Digi-Key; Manufacturer Part Number: M20-7820646; RoHS: RoHS Compliant; Category: Connectors, Interconnects; Stock 1: 255; Pricing 1: 1=0.96, 38=0.79211, 76=0.75895, 114=0.72596, 266=0.66, 532=0.594, 1026=0.528, 2508=0.4785 (USD); Packaging: Tube; Contact Type: Female Socket; Number of Rows: 1; Row Spacing: -; Mounting Type: Through Hole; Termination: Solder; Fastening Type: -; Features: -; Contact Finish: Tin; Contact Finish Thickness: -; Color: Black; ComponentLink1URL: http://cdn.harwin.com/pdfs/M20-782.pdf; ComponentLink1Description: http://cdn.harwin.com/pdfs/M20-782.pdf; Supplier Part Number 1: 952-1809-ND
J10 J11 = M20-7820842: 08-WAY SIL VERT SOCKET L/FREE; Manufacturer: Harwin Inc.; Connector Type: Receptacle; Number of Positions: 8; Number of Positions Loaded: All; Pitch: 0.100" (2.54mm); Supplier 1: Digi-Key; Manufacturer Part Number: M20-7820842; RoHS: RoHS Compliant; Category: Connectors, Interconnects; Stock 1: 0; Pricing 1: 1=1.1, 29=0.91207, 58=0.87397, 116=0.83603, 261=0.76, 522=0.684, 1015=0.608, 2523=0.551 (USD); Packaging: Tube; Contact Type: Female Socket; Number of Rows: 1; Row Spacing: -; Mounting Type: Through Hole; Termination: Solder; Fastening Type: -; Features: -; Contact Finish: Gold; Contact Finish Thickness: Flash; Color: Black; ComponentLink1URL: http://cdn.harwin.com/pdfs/M20-782.pdf; ComponentLink1Description: http://cdn.harwin.com/pdfs/M20-782.pdf; Supplier Part Number 1: 952-1823-ND
R9 R16 = RC0805FR-0722RL: as R5 on sheet [03] - ALIMENTACAO; Supplier 1: Digi-Key; Manufacturer Part Number: RC0805FR-0722RL; RoHS: RoHS Compliant; Category: Resistors; Stock 1: 106658; Pricing 1: 1=0.1, 10=0.021, 25=0.0152, 100=0.0084, 250=0.00644, 500=0.00514, 1000=0.00379, 2500=0.00329 (USD); Packaging: Cut Tape (CT); Tolerance: ±1%; Composition: Thick Film; Features: Moisture Resistant; Operating Temperature: -55°C ~ 155°C; Package / Case: 0805 (2012 Metric); Supplier Device Package: 0805; Size / Dimension: 0.079" L x 0.049" W (2.00mm x 1.25mm); Height: 0.024" (0.60mm); Number of Terminations: 2; ComponentLink1URL: http://www.yageo.com/NewPortal/yageodocoutput?fileName=/pdf/R-Chip/PYu-RC_Group_51_RoHS_L_3.pdf; ComponentLink1Description: http://www.yageo.com/NewPortal/yageodocoutput?fileName=/pdf/R-Chip/PYu-RC_Group_51_RoHS_L_3.pdf; Supplier Part Number 1: 311-22.0CRCT-ND
R10 = RC0805FR-071ML: as R7 on sheet [03] - ALIMENTACAO; Supplier 1: Digi-Key; Manufacturer Part Number: RC0805FR-071ML; RoHS: RoHS Compliant; Category: Resistors; Stock 1: 426248; Pricing 1: 1=0.1, 10=0.021, 25=0.0152, 100=0.0084, 250=0.00644, 500=0.00514, 1000=0.00379, 2500=0.00329 (USD); Packaging: Cut Tape (CT); Resistance (Ohms): 1M; Tolerance: ±1%; Composition: Thick Film; Features: Moisture Resistant; Operating Temperature: -55°C ~ 155°C; Package / Case: 0805 (2012 Metric); Supplier Device Package: 0805; Size / Dimension: 0.079" L x 0.049" W (2.00mm x 1.25mm); Height: 0.024" (0.60mm); Number of Terminations: 2; ComponentLink1URL: http://www.yageo.com/NewPortal/yageodocoutput?fileName=/pdf/R-Chip/PYu-RC_Group_51_RoHS_L_3.pdf; ComponentLink1Description: http://www.yageo.com/NewPortal/yageodocoutput?fileName=/pdf/R-Chip/PYu-RC_Group_51_RoHS_L_3.pdf; Supplier Part Number 1: 311-1.00MCRCT-ND
R11 R12 = RC0805FR-071KL: RES SMD 1K OHM 1% 1/8W 0805; Manufacturer: Yageo; Power (Watts): 0.125W, 1/8W; Temperature Coefficient: ±100ppm/°C; Supplier 1: Digi-Key; Manufacturer Part Number: RC0805FR-071KL; RoHS: RoHS Compliant; Category: Resistors; Stock 1: 2894210; Pricing 1: 1=0.1, 10=0.021, 25=0.0152, 100=0.0084, 250=0.00644, 500=0.00514, 1000=0.00379, 2500=0.00329 (USD); Packaging: Cut Tape (CT); Resistance (Ohms): 1k; Tolerance: ±1%; Composition: Thick Film; Features: Moisture Resistant; Operating Temperature: -55°C ~ 155°C; Package / Case: 0805 (2012 Metric); Supplier Device Package: 0805; Size / Dimension: 0.079" L x 0.049" W (2.00mm x 1.25mm); Height: 0.024" (0.60mm); Number of Terminations: 2; ComponentLink1URL: http://www.yageo.com/NewPortal/yageodocoutput?fileName=/pdf/R-Chip/PYu-RC_Group_51_RoHS_L_3.pdf; ComponentLink1Description: http://www.yageo.com/NewPortal/yageodocoutput?fileName=/pdf/R-Chip/PYu-RC_Group_51_RoHS_L_3.pdf; Supplier Part Number 1: 311-1.00KCRCT-ND
R13 R14 = RC0805FR-07560RL: as R3 on sheet [03] - ALIMENTACAO; Supplier 1: Digi-Key; Manufacturer Part Number: RC0805FR-07560RL; RoHS: RoHS Compliant; Category: Resistors; Stock 1: 245556; Pricing 1: 1=0.1, 10=0.021, 25=0.0152, 100=0.0084, 250=0.00644, 500=0.00514, 1000=0.00379, 2500=0.00329 (USD); Packaging: Cut Tape (CT); Tolerance: ±1%; Composition: Thick Film; Features: Moisture Resistant; Operating Temperature: -55°C ~ 155°C; Package / Case: 0805 (2012 Metric); Supplier Device Package: 0805; Size / Dimension: 0.079" L x 0.049" W (2.00mm x 1.25mm); Height: 0.024" (0.60mm); Number of Terminations: 2; ComponentLink1URL: http://www.yageo.com/NewPortal/yageodocoutput?fileName=/pdf/R-Chip/PYu-RC_Group_51_RoHS_L_3.pdf; ComponentLink1Description: http://www.yageo.com/NewPortal/yageodocoutput?fileName=/pdf/R-Chip/PYu-RC_Group_51_RoHS_L_3.pdf; Supplier Part Number 1: 311-560CRCT-ND
R15 = RC0805FR-0710KL: RES SMD 10K OHM 1% 1/8W 0805; Manufacturer: Yageo; Power (Watts): 0.125W, 1/8W; Temperature Coefficient: ±100ppm/°C; Supplier 1: Digi-Key; Manufacturer Part Number: RC0805FR-0710KL; RoHS: RoHS Compliant; Category: Resistors; Stock 1: 4526802; Pricing 1: 1=0.1, 10=0.021, 25=0.0152, 100=0.0084, 250=0.00644, 500=0.00514, 1000=0.00379, 2500=0.00329 (USD); Packaging: Cut Tape (CT); Resistance (Ohms): 10k; Tolerance: ±1%; Composition: Thick Film; Features: Moisture Resistant; Operating Temperature: -55°C ~ 155°C; Package / Case: 0805 (2012 Metric); Supplier Device Package: 0805; Size / Dimension: 0.079" L x 0.049" W (2.00mm x 1.25mm); Height: 0.024" (0.60mm); Number of Terminations: 2; ComponentLink1URL: http://www.yageo.com/NewPortal/yageodocoutput?fileName=/pdf/R-Chip/PYu-RC_Group_51_RoHS_L_3.pdf; ComponentLink1Description: http://www.yageo.com/NewPortal/yageodocoutput?fileName=/pdf/R-Chip/PYu-RC_Group_51_RoHS_L_3.pdf; Supplier Part Number 1: 311-10.0KCRCT-ND
SW1 = FSM4JH: Tactile Switches SPST OFF-(ON) Round pushbutton; Manufacturer: TE Connectivity / Alcoswitch; Current Rating: 50 mA; Operating Force: 1.6 N; Voltage Rating DC: 12 VDC; Ground Terminal: No; Mounting Direction: Vertical; Supplier 1: Mouser; Manufacturer Part Number: FSM4JH; RoHS: RoHS Compliant; Category: Tactile Switches; Stock 1: 42422; Pricing 1: 1=0.100, 25=0.075, 50=0.069, 100=0.066, 250=0.063, 500=0.058, 1000=0.054, 2000=0.051, 5000=0.050 (USD); Actuator: Round; Contact Form: SPST; Packaging: Bulk; Switch Function: OFF - (ON); Termination Style: Solder Pin; Brand: TE Connectivity / Alcoswitch; Mounting Style: Through Hole; Standard Pack Qty: 750; RoHS - Mouser: Y; Minimum Order Quantity: 1; Reeling: False; ComponentLink1URL: http://www.mouser.com/ds/2/418/NG_CD_1825910_C9-679020.pdf; ComponentLink1Description: http://www.mouser.com/ds/2/418/NG_CD_1825910_C9-679020.pdf; Supplier Part Number 1: 506-FSM4JH
U2 = ATMEGA328P-AU: 8-bit Microcontrollers - MCU 32KB In-system Flash 20MHz 1.8V-5.5V; Manufacturer: Microchip Technology / Atmel; Data RAM Size: 2 kB; Data RAM Type: SRAM; Data ROM Size: 1 kB; Data ROM Type: EEPROM; Interface Type: I2C, SPI, USART; Number of I/Os: 23 I/O; ADC Resolution: 10 bit; Core: AVR; Data Bus Width: 8 bit; Number of ADC Channels: 8; Number of Timers/Counters: 3 Timer; Operating Supply Voltage: 1.8 V to 5.5 V; Processor Series: megaAVR; Supply Voltage - Max: 5.5 V; Supply Voltage - Min: 1.8 V; Supplier 1: Mouser; Manufacturer Part Number: ATMEGA328P-AU; RoHS: RoHS Compliant; Category: 8-bit Microcontrollers - MCU; Stock 1: 28109; Pricing 1: 1=2.07, 25=1.89, 100=1.72, 1000=1.64 (USD); Height: 1 mm; Length: 7 mm; Package / Case: TQFP-32; Packaging: Tray; Product: MCU; Program Memory Type: Flash; Series: ATMEGA328; Width: 7 mm; Brand: Microchip Technology / Atmel; Mounting Style: SMD/SMT; Program Memory Size: 32 kB; Maximum Clock Frequency: 20 MHz; Maximum Operating Temperature: + 85 C; Minimum Operating Temperature: - 40 C; Moisture Sensitive: Yes; Standard Pack Qty: 250; Tradename: ATMEGA; RoHS - Mouser: Y; Minimum Order Quantity: 1; Reeling: False; ComponentLink1URL: http://www.mouser.com/ds/2/268/atmel-8271-8-bit-avr-microcontroller-atmega48a-48p-1065900.pdf; ComponentLink1Description: http://www.mouser.com/ds/2/268/atmel-8271-8-bit-avr-microcontroller-atmega48a-48p-1065900.pdf; Supplier Part Number 1: 556-ATMEGA328P-AU
Y2 = FOXSDLF/160-20: Crystals 16MHz 20pF; Manufacturer: Fox; Frequency Stability: 50 PPM; Supplier 1: Mouser; Manufacturer Part Number: FOXSDLF/160-20; RoHS: RoHS Compliant; Category: Crystals; Stock 1: 1632; Pricing 1: 1=0.270, 10=0.225, 50=0.203, 100=0.180, 500=0.171, 1000=0.144, 2000=0.135, 5000=0.130, 10000=0.126 (USD); Frequency: 16 MHz; Height: 4.5 mm; Length: 13.9 mm; Load Capacitance: 20 pF; Package / Case: HC-49/US; Packaging: Cut Tape; Series: FOXSDLF; Termination Style: SMD/SMT; Tolerance: 50 PPM; Width: 5 mm; Brand: Fox; Mounting Style: SMD/SMT; Maximum Operating Temperature: + 70 C; Minimum Operating Temperature: - 10 C; Standard Pack Qty: 1000; RoHS - Mouser: Y; Minimum Order Quantity: 1; Reeling: True; ComponentLink1URL: http://www.mouser.com/ds/2/160/C4SD-1131563.pdf; ComponentLink1Description: http://www.mouser.com/ds/2/160/C4SD-1131563.pdf; Supplier Part Number 1: 559-FOXSD160-20-LF

## Nets that join several sheets
+3V3: [03] - ALIMENTACAO (C4.2 FB1.2 Q1.3), [02] - MICROCONTROLADOR (C23.2 J11.4)
+5V: [03] - ALIMENTACAO (6 pins), [02] - MICROCONTROLADOR (13 pins)
GND: [01] - TOP VIEW (MH1.1 MH2.1 MH3.1), [03] - ALIMENTACAO (22 pins), [02] - MICROCONTROLADOR (23 pins)
NetR11_2: [03] - ALIMENTACAO (U1.2), [02] - MICROCONTROLADOR (R11.2)
NetR12_2: [03] - ALIMENTACAO (U1.3), [02] - MICROCONTROLADOR (R12.2)
RESET: [03] - ALIMENTACAO (C5.2), [02] - MICROCONTROLADOR (5 pins)

## Assembly variants
Custom: not fitted R1 R2
Alimentação externa: not fitted JP1 LINK1 R2
Alimentação USB: not fitted J5 JP1 LINK1 R1